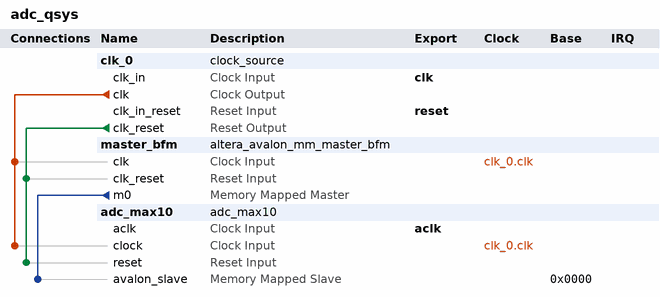
[diagram p0: system contents]
# Platform Designer (Qsys) system adc_qsys, MAX 10 10M50SAE144C8G
# Parameters at their usual value, and those the tool derives, are not listed.
package require -exact qsys 18.0
create_system adc_qsys
set_project_property DEVICE_FAMILY {MAX 10}
set_project_property DEVICE 10M50SAE144C8G

add_instance clk_0 clock_source 18.0
set_instance_parameter_value clk_0 clockFrequency 100000000

add_instance master_bfm altera_avalon_mm_master_bfm 18.0
set_instance_parameter_value master_bfm ADDRESS_UNITS WORDS
set_instance_parameter_value master_bfm ASSERT_HIGH_ARBITERLOCK 0
set_instance_parameter_value master_bfm ASSERT_HIGH_LOCK 0
set_instance_parameter_value master_bfm AV_ADDRESS_W 10
set_instance_parameter_value master_bfm AV_ALWAYS_BURST_MAX_BURST 0
set_instance_parameter_value master_bfm AV_BURSTCOUNT_W 1
set_instance_parameter_value master_bfm AV_BURST_BNDR_ONLY 1
set_instance_parameter_value master_bfm AV_BURST_LINEWRAP 1
set_instance_parameter_value master_bfm AV_CONSTANT_BURST_BEHAVIOR 1
set_instance_parameter_value master_bfm AV_FIX_READ_LATENCY 1
set_instance_parameter_value master_bfm AV_MAX_PENDING_READS 4
set_instance_parameter_value master_bfm AV_MAX_PENDING_WRITES 0
set_instance_parameter_value master_bfm AV_NUMSYMBOLS 2
set_instance_parameter_value master_bfm AV_READRESPONSE_W 8
set_instance_parameter_value master_bfm AV_READ_WAIT_TIME 1
set_instance_parameter_value master_bfm AV_WRITERESPONSE_W 8
set_instance_parameter_value master_bfm USE_BURSTCOUNT 1
set_instance_parameter_value master_bfm USE_BYTE_ENABLE 1
set_instance_parameter_value master_bfm USE_READ 1
set_instance_parameter_value master_bfm USE_READ_DATA 1
set_instance_parameter_value master_bfm USE_READ_DATA_VALID 1
set_instance_parameter_value master_bfm USE_WAIT_REQUEST 1
set_instance_parameter_value master_bfm VHDL_ID 0

add_instance adc_max10 adc_max10 1.0

# connections
add_connection clk_0.clk adc_max10.clock clock
add_connection clk_0.clk master_bfm.clk clock
add_connection clk_0.clk_reset adc_max10.reset reset
add_connection clk_0.clk_reset master_bfm.clk_reset reset
add_connection master_bfm.m0 adc_max10.avalon_slave avalon
set_connection_parameter_value master_bfm.m0/adc_max10.avalon_slave baseAddress 0x0000

# exported interfaces
add_interface aclk clock sink
set_interface_property aclk EXPORT_OF adc_max10.aclk
add_interface clk clock sink
set_interface_property clk EXPORT_OF clk_0.clk_in
add_interface reset reset sink
set_interface_property reset EXPORT_OF clk_0.clk_in_reset

set_interconnect_requirement {$system} qsys_mm.clockCrossingAdapter HANDSHAKE
set_interconnect_requirement {$system} qsys_mm.enableEccProtection FALSE
set_interconnect_requirement {$system} qsys_mm.insertDefaultSlave FALSE
set_interconnect_requirement {$system} qsys_mm.maxAdditionalLatency 1

save_system adc_qsys.qsys
